# Altium schematic sheet ESP32_Schem_V2.SchDoc (part 2 of 4)
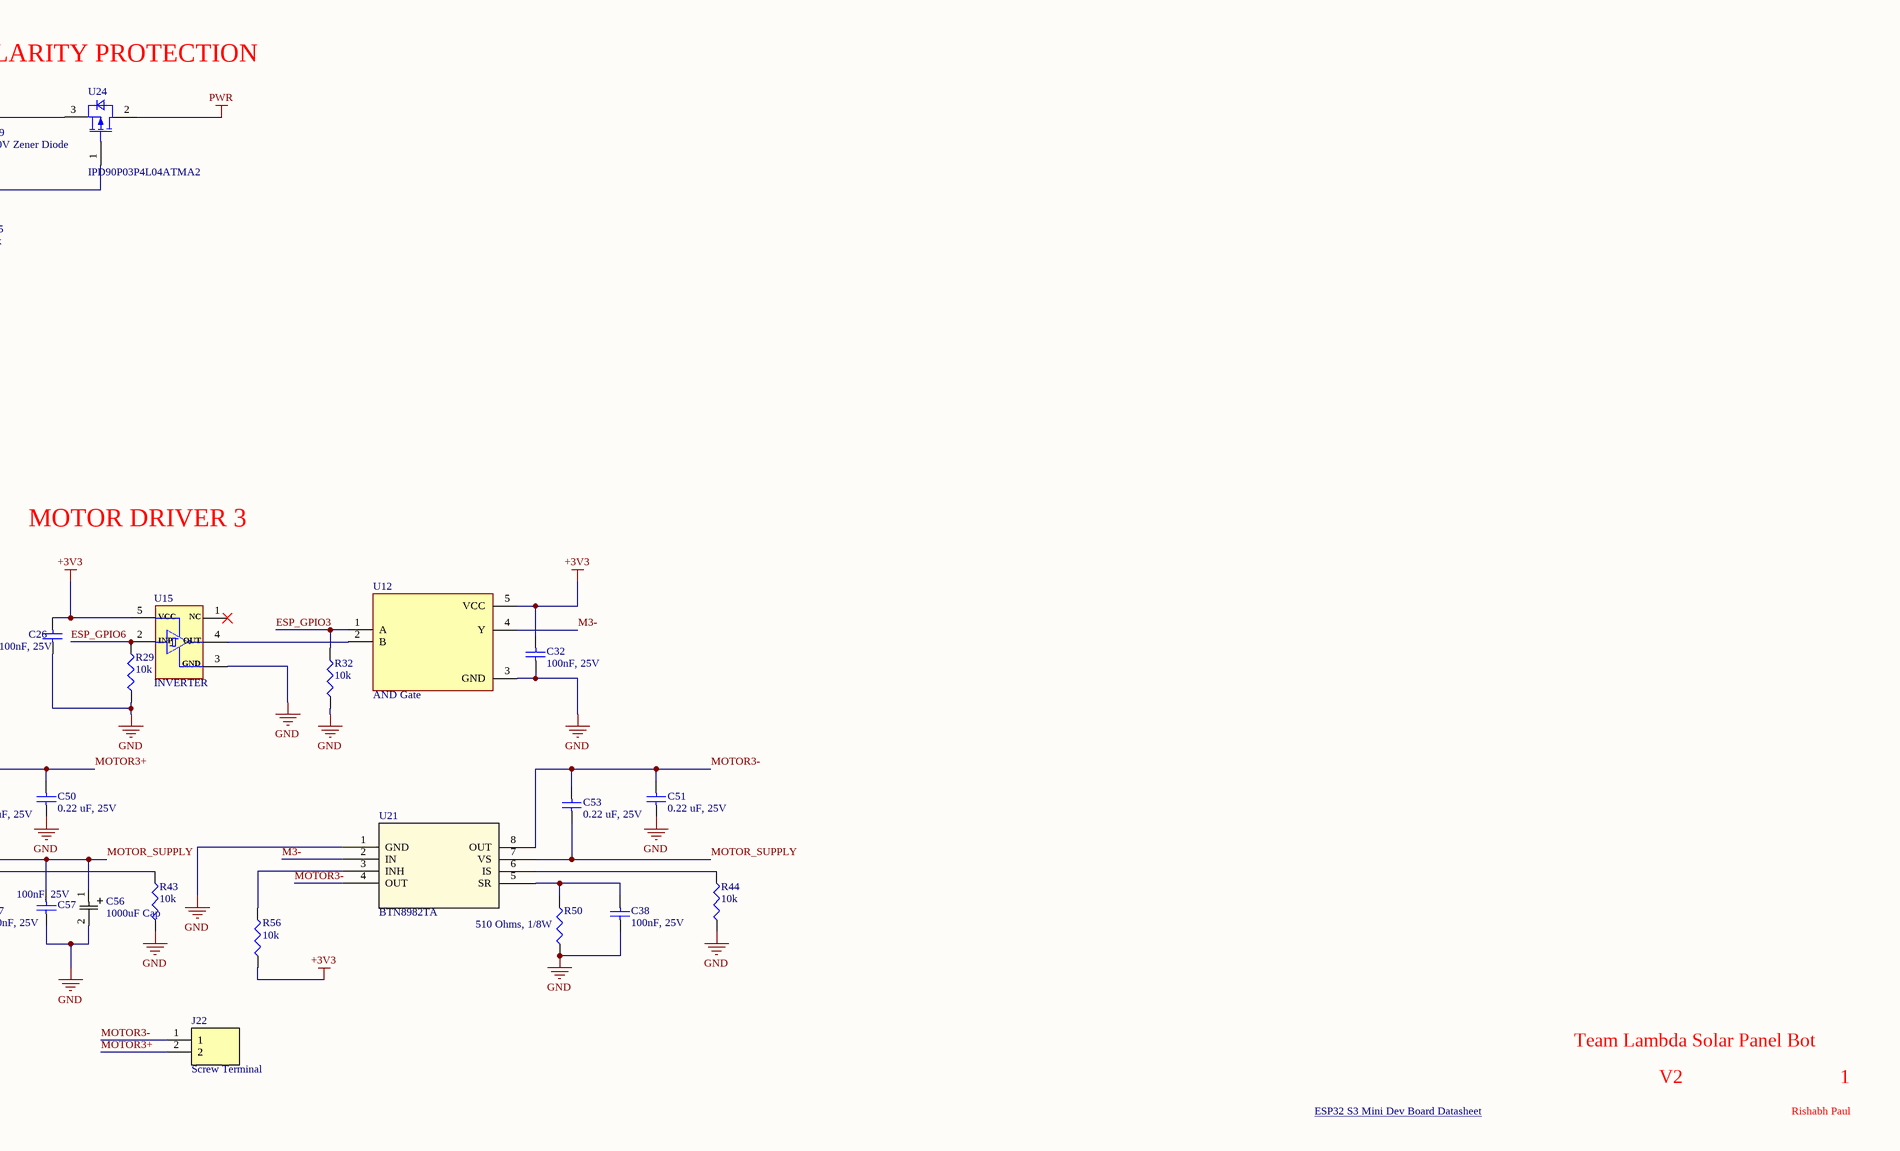
[diagram p4: ESP32_Schem_V2.SchDoc, bottom right]
## Library data of the parts
C1 C4 C19 C21-C23 C60 = CL05B104KB54PNC: Ceramic Capacitor, Multilayer, Ceramic, 50V, 10% +Tol, 10% -Tol, X7R, 15% TC, 0.1uF, Surface Mount, 0402; Manufacturer: Samsung; Supplier: Digikey; Supplier Part Number: 1276-CL05B104KB54PNCCT-ND; Manufacturer Part Number: CL05B104KB54PNC; RoHS: Yes; Category: Ceramic Capacitors; Stock: 379599; Pricing: 1=0.1, 10=0.037, 100=0.0211, 1000=0.01333, 2500=0.01141, 5000=0.01026 (USD); Pins: 2; Dielectric Material: Ceramic; Capacitor Type: Ceramic; RoHS Compliant: Yes; Reach SVHC Compliant: Yes; ComponentLink1URL: https://datasheet.ciiva.com:443/pdfs/VipMasterIC/IC/SEMS/SEMS-S-A0006318249/SEMS-S-A0006320959-1.pdf?src-supplier=IHS+Markit; ComponentLink1Description: https://datasheet.ciiva.com:443/pdfs/VipMasterIC/IC/SEMS/SEMS-S-A0006318249/SEMS-S-A0006320959-1.pdf?src-supplier=IHS+Markit; LCSC Part Number: C307331
C2 C15 C16 = CL05A106MP8NUB8: Ceramic Capacitor, Multilayer, Ceramic, 10V, 20% +Tol, 20% -Tol, X5R, 15% TC, 10uF, Surface Mount, 0402; Manufacturer: Samsung; Multilayer: Yes; Supplier: Digikey; Supplier Part Number: 1276-6830-1-ND; Manufacturer Part Number: CL05A106MP8NUB8; RoHS: Yes; Category: Ceramic Capacitors; Stock: 66904; Pricing: 1=0.16, 10=0.096, 100=0.0685 (USD); Mounting Technology: Surface Mount; Pins: 2; Dielectric Material: Ceramic; Package Shape: Rectangular; Case/Package: 0402; Terminal Finish: Nickel; Min Operating Temperature: -55°C; Max Operating Temperature: 85°C; JESD-609 Code: e3; Value: 10uF; Capacitor Type: Ceramic; Tolerance  (fill in as +-): 20%; Packaging: Tape and Reel; Tolerance (fill in as +-): 20%; Rated DC Voltage (URdc): 10V; Temperature Characteristics Code: X5R; Termination: Wraparound; Reach SVHC Compliant: Yes; RoHS Compliant: Yes; ComponentLink1URL: https://datasheet.ciiva.com:443/pdfs/VipMasterIC/IC/SEMS/SEMS-S-A0008521219/SEMS-S-A0008521325-1.pdf?src-supplier=IHS+Markit; ComponentLink1Description: https://datasheet.ciiva.com:443/pdfs/VipMasterIC/IC/SEMS/SEMS-S-A0008521219/SEMS-S-A0008521325-1.pdf?src-supplier=IHS+Markit; ComponentLink2URL: http://www.samsungsem.com/kr/support/product-search/mlcc/CL05A106MP8NUB8.jsp?src-supplier=Digikey; ComponentLink2Description: http://www.samsungsem.com/kr/support/product-search/mlcc/CL05A106MP8NUB8.jsp?src-supplier=Digikey; ComponentLink3URL: https://datasheet.octopart.com/CL05A106MP8NUB8-Samsung-Electro-Mechanics-datasheet-136460857.pdf?src-supplier=Future+Electronics; ComponentLink3Description: https://datasheet.octopart.com/CL05A106MP8NUB8-Samsung-Electro-Mechanics-datasheet-136460857.pdf?src-supplier=Future+Electronics; LCSC Part Number: C307415
C3 = CL05A105KL5NRNC: Ceramic Capacitor, Multilayer, Ceramic, 35V, 10% +Tol, 10% -Tol, X5R, 15% TC, 1uF, Surface Mount, 0402; Manufacturer: Samsung; Multilayer: Yes; Supplier: Digikey; Supplier Part Number: 1276-6796-1-ND; Manufacturer Part Number: CL05A105KL5NRNC; RoHS: Yes; Category: Ceramic Capacitors; Stock: 103267; Pricing: 1=0.29, 10=0.17, 100=0.1097, 1000=0.07829, 2500=0.07048, 5000=0.06578 (USD); Mounting Technology: Surface Mount; Pins: 2; Dielectric Material: Ceramic; Package Shape: Rectangular; Case/Package: 0402; Terminal Finish: Nickel; Min Operating Temperature: -55°C; Max Operating Temperature: 85°C; JESD-609 Code: e3; Value: 1uF; Capacitor Type: Ceramic; Tolerance  (fill in as +-): 10%; Packaging: Tape and Reel; Tolerance (fill in as +-): 10%; Rated DC Voltage (URdc): 35V; Temperature Characteristics Code: X5R; Termination: Wraparound; Reach SVHC Compliant: Yes; RoHS Compliant: Yes; ComponentLink1URL: https://datasheet.ciiva.com:443/pdfs/VipMasterIC/IC/SEMS/SEMS-S-A0008384515/SEMS-S-A0008872905-1.pdf?src-supplier=IHS+Markit; ComponentLink1Description: https://datasheet.ciiva.com:443/pdfs/VipMasterIC/IC/SEMS/SEMS-S-A0008384515/SEMS-S-A0008872905-1.pdf?src-supplier=IHS+Markit; ComponentLink2URL: http://www.samsungsem.com/kr/support/product-search/mlcc/CL05A105KL5NRNC.jsp?src-supplier=Digikey; ComponentLink2Description: http://www.samsungsem.com/kr/support/product-search/mlcc/CL05A105KL5NRNC.jsp?src-supplier=Digikey; ComponentLink3URL: https://datasheet.octopart.com/CL05A105KL5NRNC-Samsung-datasheet-8326407.pdf?src-supplier=TME; ComponentLink3Description: https://datasheet.octopart.com/CL05A105KL5NRNC-Samsung-datasheet-8326407.pdf?src-supplier=TME; LCSC Part Number: C307413
C5 C24-C38 C45 C55 C57 = CC0805KRX7R8BB104: 25V 100Nf X7R 10% 0805 Multilayer Ceramic Capacitors Mlcc Smd/Smt Rohs; Manufacturer: Yageo Group; Manufacturer Package Identifier: CC0805-0.85; Insulation Resistance: 100GΩ; Supplier: DigiKey; Supplier Part Number: 311-1141-1-ND; Manufacturer Part Number: CC0805KRX7R8BB104; RoHS: Compliant; Category: Ceramic Capacitors; ComponentLink1URL: https://datasheet.octopart.com:443/CC0805KRX7R8BB104-Yageo-datasheet-177165144.pdf?src-supplier=IHS; ComponentLink1Description: https://datasheet.octopart.com:443/CC0805KRX7R8BB104-Yageo-datasheet-177165144.pdf?src-supplier=IHS; ComponentLink2URL: https://datasheet.octopart.com:443/CC0805KRX7R8BB104-Yageo-datasheet-78855689.pdf?src-supplier=Upverter; ComponentLink2Description: https://datasheet.octopart.com:443/CC0805KRX7R8BB104-Yageo-datasheet-78855689.pdf?src-supplier=Upverter; LCSC Part Number: C519981; Stock: 145807; Pricing: 1=0.11, 10=0.059, 50=0.0406, 100=0.035, 500=0.02578, 1000=0.02295 (USD); Value: 100nF; Case/Package: 0805; Case Code (Imperial): 0805; Case Code (Metric): 2012; China RoHS: Compliant; Composition: Ceramic; Depth: 1.25mm; Dielectric: X7R; Dielectric Material: Ceramic; Halogen Free: Halogen Free; Height: 850µm; Lead Free: Lead Free; Length: 2mm; Lifecycle Status: Production; Material: Ceramic; Max Operating Temperature: 125°C; Min Operating Temperature: -55°C; Mounting Technology: Surface Mount; Pins: 2; Number of Terminals: 2; Radiation Hardening: No; REACH SVHC: Yes; Schedule B: 8532240020, 8532240020|8532240020, 8532240020|8532240020|8532240020, 8532240020|8532240020|8532240020|8532240020; Termination: SMD/SMT; Thickness: 838.2µm; Tolerance: 10%; Voltage Rating: 25V; Voltage Rating (DC): 25V; Width: 1.25mm; ComponentLink3URL: https://datasheet.octopart.com/CC0805KRX7R8BB104-Yageo-datasheet-10883670.pdf; ComponentLink3Description: https://datasheet.octopart.com/CC0805KRX7R8BB104-Yageo-datasheet-10883670.pdf; ComponentLink4URL: https://datasheet.octopart.com:443/CC0805KRX7R8BB104-Yageo-datasheet-181969809.pdf?src-supplier=Newark; ComponentLink4Description: https://datasheet.octopart.com:443/CC0805KRX7R8BB104-Yageo-datasheet-181969809.pdf?src-supplier=Newark; ComponentLink5URL: https://datasheet.octopart.com:443/CC0805KRX7R8BB104-Yageo-datasheet-147453679.pdf?src-supplier=Newark; ComponentLink5Description: https://datasheet.octopart.com:443/CC0805KRX7R8BB104-Yageo-datasheet-147453679.pdf?src-supplier=Newark; ComponentLink6URL: https://datasheet.octopart.com:443/CC0805KRX7R8BB104-Yageo-datasheet-499490.pdf?src-supplier=Newark; ComponentLink6Description: https://datasheet.octopart.com:443/CC0805KRX7R8BB104-Yageo-datasheet-499490.pdf?src-supplier=Newark; ComponentLink7URL: https://datasheet.octopart.com:443/CC0805KRX7R8BB104-Yageo-datasheet-5301394.pdf?src-supplier=Newark; ComponentLink7Description: https://datasheet.octopart.com:443/CC0805KRX7R8BB104-Yageo-datasheet-5301394.pdf?src-supplier=Newark; ComponentLink8URL: https://datasheet.octopart.com:443/CC0805KRX7R8BB104-Yageo-datasheet-62336348.pdf?src-supplier=Newark; ComponentLink8Description: https://datasheet.octopart.com:443/CC0805KRX7R8BB104-Yageo-datasheet-62336348.pdf?src-supplier=Newark; ComponentLink9URL: https://datasheet.octopart.com:443/CC0805KRX7R8BB104-Yageo-datasheet-151948686.pdf?src-supplier=Farnell; ComponentLink9Description: https://datasheet.octopart.com:443/CC0805KRX7R8BB104-Yageo-datasheet-151948686.pdf?src-supplier=Farnell; ComponentLink10URL: https://datasheet.octopart.com:443/CC0805KRX7R8BB104-Yageo-datasheet-500777.pdf?src-supplier=Farnell; ComponentLink10Description: https://datasheet.octopart.com:443/CC0805KRX7R8BB104-Yageo-datasheet-500777.pdf?src-supplier=Farnell; ComponentLink11URL: https://datasheet.octopart.com:443/CC0805KRX7R8BB104-Yageo-datasheet-166511530.pdf?src-supplier=Future+Electronics; ComponentLink11Description: https://datasheet.octopart.com:443/CC0805KRX7R8BB104-Yageo-datasheet-166511530.pdf?src-supplier=Future+Electronics; ComponentLink12URL: https://datasheet.octopart.com:443/CC0805KRX7R8BB104-Yageo-datasheet-137700082.pdf?src-supplier=Future+Electronics; ComponentLink12Description: https://datasheet.octopart.com:443/CC0805KRX7R8BB104-Yageo-datasheet-137700082.pdf?src-supplier=Future+Electronics; ComponentLink13URL: https://datasheet.octopart.com:443/CC0805KRX7R8BB104-Yageo-datasheet-137700084.pdf?src-supplier=Future+Electronics; ComponentLink13Description: https://datasheet.octopart.com:443/CC0805KRX7R8BB104-Yageo-datasheet-137700084.pdf?src-supplier=Future+Electronics; ComponentLink14URL: https://datasheet.octopart.com:443/CC0805KRX7R8BB104-Yageo-datasheet-27626582.pdf?src-supplier=Future+Electronics; ComponentLink14Description: https://datasheet.octopart.com:443/CC0805KRX7R8BB104-Yageo-datasheet-27626582.pdf?src-supplier=Future+Electronics; ComponentLink15URL: https://datasheet.octopart.com:443/CC0805KRX7R8BB104-Yageo-datasheet-15895757.pdf?src-supplier=Future+Electronics; ComponentLink15Description: https://datasheet.octopart.com:443/CC0805KRX7R8BB104-Yageo-datasheet-15895757.pdf?src-supplier=Future+Electronics; ComponentLink16URL: https://datasheet.octopart.com:443/CC0805KRX7R8BB104-Yageo-datasheet-12526321.pdf?src-supplier=Future+Electronics; ComponentLink16Description: https://datasheet.octopart.com:443/CC0805KRX7R8BB104-Yageo-datasheet-12526321.pdf?src-supplier=Future+Electronics; ComponentLink17URL: https://datasheet.octopart.com:443/CC0805KRX7R8BB104-Yageo-datasheet-8324192.pdf?src-supplier=Future+Electronics; ComponentLink17Description: https://datasheet.octopart.com:443/CC0805KRX7R8BB104-Yageo-datasheet-8324192.pdf?src-supplier=Future+Electronics; ComponentLink18URL: https://datasheet.octopart.com:443/CC0805KRX7R8BB104-Yageo-Group-datasheet-165992755.pdf?src-supplier=ODG+(Origin+Data+Global); ComponentLink18Description: https://datasheet.octopart.com:443/CC0805KRX7R8BB104-Yageo-Group-datasheet-165992755.pdf?src-supplier=ODG+(Origin+Data+Global); ComponentLink19URL: https://datasheet.octopart.com:443/CC0805KRX7R8BB104-Yageo-datasheet-8701427.pdf?src-supplier=element14; ComponentLink19Description: https://datasheet.octopart.com:443/CC0805KRX7R8BB104-Yageo-datasheet-8701427.pdf?src-supplier=element14; ComponentLink20URL: https://datasheet.octopart.com:443/CC0805KRX7R8BB104-Yageo-datasheet-8555986.pdf?src-supplier=TME; ComponentLink20Description: https://datasheet.octopart.com:443/CC0805KRX7R8BB104-Yageo-datasheet-8555986.pdf?src-supplier=TME; ComponentLink21URL: https://datasheet.octopart.com:443/CC0805KRX7R8BB104-Yageo-datasheet-17600895.pdf?src-supplier=TME; ComponentLink21Description: https://datasheet.octopart.com:443/CC0805KRX7R8BB104-Yageo-datasheet-17600895.pdf?src-supplier=TME; ComponentLink22URL: https://datasheet.octopart.com:443/CC0805KRX7R8BB104-Yageo-datasheet-118396.pdf?src-supplier=DigiKey; ComponentLink22Description: https://datasheet.octopart.com:443/CC0805KRX7R8BB104-Yageo-datasheet-118396.pdf?src-supplier=DigiKey; ComponentLink23URL: http://sigma.octopart.com:80/conflict_mineral_statement/Yageo-company-3.pdf?src-supplier=Compliance+Statements; ComponentLink23Description: http://sigma.octopart.com:80/conflict_mineral_statement/Yageo-company-3.pdf?src-supplier=Compliance+Statements; ComponentLink24URL: http://sigma.octopart.com:80/rohs_statement/Yageo-company-2.pdf?src-supplier=Compliance+Statements; ComponentLink24Description: http://sigma.octopart.com:80/rohs_statement/Yageo-company-2.pdf?src-supplier=Compliance+Statements
C6 C20 = CL05A475MO5NUNC: Ceramic Capacitor, Multilayer, Ceramic, 16V, 20% +Tol, 20% -Tol, X5R, 15% TC, 4.7uF, Surface Mount, 0402; Manufacturer: Samsung; Multilayer: Yes; Supplier: Digikey; Supplier Part Number: 1276-6836-1-ND; Manufacturer Part Number: CL05A475MO5NUNC; RoHS: Yes; Category: Ceramic Capacitors; Stock: 55189; Pricing: 1=0.19, 10=0.114, 100=0.0851 (USD); Mounting Technology: Surface Mount; Pins: 2; Dielectric Material: Ceramic; Package Shape: Rectangular; Case/Package: 0402; Terminal Finish: Nickel; Min Operating Temperature: -55°C; Max Operating Temperature: 85°C; JESD-609 Code: e3; Value: 4.7uF; Capacitor Type: Ceramic; Tolerance  (fill in as +-): 20%; Package Style: SMTMeter; Packaging: Tape and Reel; Tolerance (fill in as +-): 20%; Rated DC Voltage (URdc): 16V; Temperature Characteristics Code: X5R; Termination: Wraparound; Length: 1mm; Width: 0.5mm; Height: 0.7mm; Reach SVHC Compliant: Yes; RoHS Compliant: Yes; ComponentLink1URL: https://datasheet.ciiva.com:443/pdfs/VipMasterIC/IC/SEMS/SEMS-S-A0008384515/SEMS-S-A0008898881-1.pdf?src-supplier=IHS+Markit; ComponentLink1Description: https://datasheet.ciiva.com:443/pdfs/VipMasterIC/IC/SEMS/SEMS-S-A0008384515/SEMS-S-A0008898881-1.pdf?src-supplier=IHS+Markit; ComponentLink2URL: http://www.farnell.com/datasheets/2710653.pdf?src-supplier=Farnell; ComponentLink2Description: http://www.farnell.com/datasheets/2710653.pdf?src-supplier=Farnell; ComponentLink3URL: http://www.samsungsem.com/kr/support/product-search/mlcc/CL05A475MO5NUNC.jsp?src-supplier=Digikey; ComponentLink3Description: http://www.samsungsem.com/kr/support/product-search/mlcc/CL05A475MO5NUNC.jsp?src-supplier=Digikey; ComponentLink4URL: http://www.farnell.com/datasheets/2710653.pdf?src-supplier=Newark; ComponentLink4Description: http://www.farnell.com/datasheets/2710653.pdf?src-supplier=Newark; ComponentLink5URL: http://www.farnell.com/datasheets/2710653.pdf?src-supplier=Element14; ComponentLink5Description: http://www.farnell.com/datasheets/2710653.pdf?src-supplier=Element14; ComponentLink6URL: https://datasheet.octopart.com/CL05A475MO5NUNC-Samsung-Electro-Mechanics-datasheet-123102911.pdf?src-supplier=Future+Electronics; ComponentLink6Description: https://datasheet.octopart.com/CL05A475MO5NUNC-Samsung-Electro-Mechanics-datasheet-123102911.pdf?src-supplier=Future+Electronics; LCSC Part Number: C318563
C17 C39 C61 = TMK212BBJ106KG-T: CAP CER 10UF 25V X5R 0805; Manufacturer: TAIYO YUDEN; Value: 10µF; Dielectric Material: Ceramic; Tolerance: 10%; Voltage: 16V; Supplier: DigiKey; Supplier Part Number: 587-2985-1-ND; Manufacturer Part Number: TMK212BBJ106KG-T; RoHS: Compliant; Category: Ceramic Capacitors; Stock: 1004631; Pricing: 1=0.16, 10=0.088, 50=0.0622, 100=0.0543, 500=0.04086, 1000=0.03673 (USD); LCSC Part Number: C386085; Case/Package: 0805; Case Code (Imperial): 0805; Case Code (Metric): 2012; Composition: Ceramic; Dielectric: X5R; Height: 1.25mm; Lead Free: Lead Free; Length: 2mm; Lifecycle Status: Production; Material: Ceramic; Max Operating Temperature: 85°C; Min Operating Temperature: -55°C; Mounting Technology: Surface Mount; Pins: 2; Number of Terminals: 2; REACH SVHC: Yes; Termination: SMD/SMT; Thickness: 1.3462mm; Voltage Rating: 25V; Voltage Rating (DC): 25V; Width: 1.25mm; ComponentLink1URL: https://datasheet.octopart.com:443/TMK212BBJ106KG-T-Taiyo-Yuden-datasheet-182120866.pdf?src-supplier=IHS; ComponentLink1Description: https://datasheet.octopart.com:443/TMK212BBJ106KG-T-Taiyo-Yuden-datasheet-182120866.pdf?src-supplier=IHS; ComponentLink2URL: https://datasheet.octopart.com:443/TMK212BBJ106KG-T-Taiyo-Yuden-datasheet-181961944.pdf?src-supplier=Newark; ComponentLink2Description: https://datasheet.octopart.com:443/TMK212BBJ106KG-T-Taiyo-Yuden-datasheet-181961944.pdf?src-supplier=Newark; ComponentLink3URL: https://datasheet.octopart.com:443/TMK212BBJ106KG-T-Taiyo-Yuden-datasheet-23715841.pdf?src-supplier=Newark; ComponentLink3Description: https://datasheet.octopart.com:443/TMK212BBJ106KG-T-Taiyo-Yuden-datasheet-23715841.pdf?src-supplier=Newark; ComponentLink4URL: https://datasheet.octopart.com:443/TMK212BBJ106KG-T-Taiyo-Yuden-datasheet-10851928.pdf?src-supplier=element14+APAC; ComponentLink4Description: https://datasheet.octopart.com:443/TMK212BBJ106KG-T-Taiyo-Yuden-datasheet-10851928.pdf?src-supplier=element14+APAC; ComponentLink5URL: https://datasheet.octopart.com:443/TMK212BBJ106KG-T-Taiyo-Yuden-datasheet-154810078.pdf?src-supplier=Master+Electronics; ComponentLink5Description: https://datasheet.octopart.com:443/TMK212BBJ106KG-T-Taiyo-Yuden-datasheet-154810078.pdf?src-supplier=Master+Electronics; ComponentLink6URL: https://datasheet.octopart.com:443/TMK212BBJ106KG-T-Taiyo-Yuden-datasheet-10742123.pdf?src-supplier=Future+Electronics; ComponentLink6Description: https://datasheet.octopart.com:443/TMK212BBJ106KG-T-Taiyo-Yuden-datasheet-10742123.pdf?src-supplier=Future+Electronics; ComponentLink7URL: https://datasheet.octopart.com:443/TMK212BBJ106KG-T-Taiyo-Yuden-datasheet-99833418.pdf?src-supplier=Future+Electronics; ComponentLink7Description: https://datasheet.octopart.com:443/TMK212BBJ106KG-T-Taiyo-Yuden-datasheet-99833418.pdf?src-supplier=Future+Electronics; ComponentLink8URL: https://datasheet.octopart.com:443/TMK212BBJ106KG-T-Taiyo-Yuden-datasheet-138738940.pdf?src-supplier=Taiyo+Yuden+SCT; ComponentLink8Description: https://datasheet.octopart.com:443/TMK212BBJ106KG-T-Taiyo-Yuden-datasheet-138738940.pdf?src-supplier=Taiyo+Yuden+SCT; ComponentLink9URL: https://datasheet.octopart.com:443/TMK212BBJ106KG-T-Taiyo-Yuden-datasheet-27089299.pdf?src-supplier=Electro+Sonic; ComponentLink9Description: https://datasheet.octopart.com:443/TMK212BBJ106KG-T-Taiyo-Yuden-datasheet-27089299.pdf?src-supplier=Electro+Sonic
C18 C58 = C1608X5R1A226M080AC: CAP CER 22UF 10V X5R 0603; Manufacturer: TDK; Dielectric Material: Ceramic; Multilayer: Yes; Tolerance  (fill in as +-): 20%; Supplier: Digikey; Supplier Part Number: 445-9077-1-ND; Manufacturer Part Number: C1608X5R1A226M080AC; RoHS: Yes; Category: Ceramic Capacitors; Stock: 11207; Pricing: 1=0.29, 10=0.169, 50=0.123, 100=0.092, 500=0.0849, 1000=0.07756 (USD); Mounting Technology: Surface Mount; Pins: 2; Package Shape: Rectangular; Case/Package: 0603; Terminal Finish: Nickel; Min Operating Temperature: -55°C; Max Operating Temperature: 85°C; JESD-609 Code: e3; Value: 22uF; Capacitor Type: Ceramic; Package Style: SMTMeter; Packaging: Tape and Reel; Tolerance (fill in as +-): 20%; Rated DC Voltage (URdc): 10V; Temperature Characteristics Code: X5R; Termination: Wraparound; Length: 1.6mm; Width: 0.8mm; Height: 0.8mm; Reach SVHC Compliant: Yes; RoHS Compliant: Yes; ComponentLink1URL: https://datasheet.ciiva.com:443/pdfs/VipMasterIC/IC/TDKC/TDKC-S-A0008796792/TDKC-S-A0008796792-1.pdf?src-supplier=IHS+Markit; ComponentLink1Description: https://datasheet.ciiva.com:443/pdfs/VipMasterIC/IC/TDKC/TDKC-S-A0008796792/TDKC-S-A0008796792-1.pdf?src-supplier=IHS+Markit; ComponentLink2URL: http://www.farnell.com/datasheets/2792994.pdf?src-supplier=Farnell; ComponentLink2Description: http://www.farnell.com/datasheets/2792994.pdf?src-supplier=Farnell; ComponentLink3URL: http://www.farnell.com/datasheets/2792994.pdf?src-supplier=Element14; ComponentLink3Description: http://www.farnell.com/datasheets/2792994.pdf?src-supplier=Element14; ComponentLink4URL: https://datasheet.octopart.com/C1608X5R1A226M080AC-TDK-datasheet-13444418.pdf?src-supplier=Future+Electronics; ComponentLink4Description: https://datasheet.octopart.com/C1608X5R1A226M080AC-TDK-datasheet-13444418.pdf?src-supplier=Future+Electronics; ComponentLink5URL: https://datasheet.octopart.com/C1608X5R1A226M080AC-TDK-datasheet-82475248.pdf?src-supplier=Newark; ComponentLink5Description: https://datasheet.octopart.com/C1608X5R1A226M080AC-TDK-datasheet-82475248.pdf?src-supplier=Newark; LCSC Part Number: C342824
C40-C43 C46-C53 = CC0603KRX7R8BB224: CAP CER 0.22UF 25V X7R 0603; Manufacturer: Yageo Group; Value: 220nF; Dielectric Material: Ceramic; Tolerance: 10%; Supplier: DigiKey; Supplier Part Number: 311-1803-1-ND; Manufacturer Part Number: CC0603KRX7R8BB224; RoHS: Compliant; Category: Ceramic Capacitors; Stock: 24200; Pricing: 1=0.12, 10=0.069, 50=0.048, 100=0.0416, 500=0.0309, 1000=0.02761 (USD); Case/Package: 0603; Case Code (Imperial): 0603; Case Code (Metric): 1608; China RoHS: Compliant; Composition: Ceramic; Depth: 800µm; Dielectric: X7R; Halogen Free: Halogen Free; Height: 800µm; Lead Free: Lead Free; Length: 1.6mm; Lifecycle Status: Production; Material: Ceramic; Max Operating Temperature: 125°C; Min Operating Temperature: -55°C; Mounting Technology: Surface Mount; Pins: 2; Number of Terminals: 2; Packaging: Tape and Reel; Radiation Hardening: No; REACH SVHC: Yes; Schedule B: 8532240020, 8532240020|8532240020, 8532240020|8532240020|8532240020, 8532240020|8532240020|8532240020|8532240020; Termination: SMD/SMT; Thickness: 889µm; Voltage: 25V; Voltage Rating: 25V; Voltage Rating (DC): 25V; Width: 800µm; ComponentLink1URL: https://datasheet.octopart.com:443/CC0603KRX7R8BB224-Yageo-datasheet-177165144.pdf?src-supplier=IHS; ComponentLink1Description: https://datasheet.octopart.com:443/CC0603KRX7R8BB224-Yageo-datasheet-177165144.pdf?src-supplier=IHS; ComponentLink2URL: https://datasheet.octopart.com:443/CC0603KRX7R8BB224-Yageo-datasheet-82288757.pdf?src-supplier=Upverter; ComponentLink2Description: https://datasheet.octopart.com:443/CC0603KRX7R8BB224-Yageo-datasheet-82288757.pdf?src-supplier=Upverter; ComponentLink3URL: https://datasheet.octopart.com:443/CC0603KRX7R8BB224-Yageo-datasheet-181968713.pdf?src-supplier=Newark; ComponentLink3Description: https://datasheet.octopart.com:443/CC0603KRX7R8BB224-Yageo-datasheet-181968713.pdf?src-supplier=Newark; ComponentLink4URL: https://datasheet.octopart.com:443/CC0603KRX7R8BB224-Yageo-datasheet-140260305.pdf?src-supplier=Newark; ComponentLink4Description: https://datasheet.octopart.com:443/CC0603KRX7R8BB224-Yageo-datasheet-140260305.pdf?src-supplier=Newark; ComponentLink5URL: https://datasheet.octopart.com:443/CC0603KRX7R8BB224-Yageo-datasheet-147453679.pdf?src-supplier=Farnell; ComponentLink5Description: https://datasheet.octopart.com:443/CC0603KRX7R8BB224-Yageo-datasheet-147453679.pdf?src-supplier=Farnell; ComponentLink6URL: https://datasheet.octopart.com:443/CC0603KRX7R8BB224-Yageo-Group-datasheet-188689702.pdf?src-supplier=Farnell; ComponentLink6Description: https://datasheet.octopart.com:443/CC0603KRX7R8BB224-Yageo-Group-datasheet-188689702.pdf?src-supplier=Farnell; ComponentLink7URL: https://datasheet.octopart.com:443/CC0603KRX7R8BB224-Yageo-datasheet-27626582.pdf?src-supplier=Future+Electronics; ComponentLink7Description: https://datasheet.octopart.com:443/CC0603KRX7R8BB224-Yageo-datasheet-27626582.pdf?src-supplier=Future+Electronics; ComponentLink8URL: https://datasheet.octopart.com:443/CC0603KRX7R8BB224-Yageo-datasheet-166511530.pdf?src-supplier=Future+Electronics; ComponentLink8Description: https://datasheet.octopart.com:443/CC0603KRX7R8BB224-Yageo-datasheet-166511530.pdf?src-supplier=Future+Electronics; ComponentLink9URL: https://datasheet.octopart.com:443/CC0603KRX7R8BB224-Yageo-datasheet-137700082.pdf?src-supplier=Future+Electronics; ComponentLink9Description: https://datasheet.octopart.com:443/CC0603KRX7R8BB224-Yageo-datasheet-137700082.pdf?src-supplier=Future+Electronics; ComponentLink10URL: https://datasheet.octopart.com:443/CC0603KRX7R8BB224-Yageo-datasheet-42079887.pdf?src-supplier=Future+Electronics; ComponentLink10Description: https://datasheet.octopart.com:443/CC0603KRX7R8BB224-Yageo-datasheet-42079887.pdf?src-supplier=Future+Electronics; ComponentLink11URL: https://datasheet.octopart.com/CC0603KRX7R8BB224-Yageo-datasheet-10883670.pdf; ComponentLink11Description: https://datasheet.octopart.com/CC0603KRX7R8BB224-Yageo-datasheet-10883670.pdf; ComponentLink12URL: https://datasheet.octopart.com/Surface-Mount-Ceramic-Multilayer-Capacitors%3B-General-Purpose-%26-High-Capacitance-Class-2%2C-X7R-Yageo-datasheet-family-114.pdf; ComponentLink12Description: https://datasheet.octopart.com/Surface-Mount-Ceramic-Multilayer-Capacitors%3B-General-Purpose-%26-High-Capacitance-Class-2%2C-X7R-Yageo-datasheet-family-114.pdf; ComponentLink13URL: https://datasheet.octopart.com:443/CC0603KRX7R8BB224-Yageo-Group-datasheet-165992755.pdf?src-supplier=ODG+(Origin+Data+Global); ComponentLink13Description: https://datasheet.octopart.com:443/CC0603KRX7R8BB224-Yageo-Group-datasheet-165992755.pdf?src-supplier=ODG+(Origin+Data+Global); ComponentLink14URL: https://datasheet.octopart.com:443/CC0603KRX7R8BB224-Yageo-datasheet-151948686.pdf?src-supplier=TME; ComponentLink14Description: https://datasheet.octopart.com:443/CC0603KRX7R8BB224-Yageo-datasheet-151948686.pdf?src-supplier=TME; ComponentLink15URL: https://datasheet.octopart.com:443/CC0603KRX7R8BB224-Yageo-datasheet-120101875.pdf?src-supplier=Megastar; ComponentLink15Description: https://datasheet.octopart.com:443/CC0603KRX7R8BB224-Yageo-datasheet-120101875.pdf?src-supplier=Megastar; ComponentLink16URL: http://sigma.octopart.com:80/rohs_statement/Surface-Mount-Ceramic-Multilayer-Capacitors%3B-General-Purpose-%26-High-Capacitance-Class-2%2C-X7R-Yageo-family-124.pdf?src-supplier=Compliance+Statements; ComponentLink16Description: http://sigma.octopart.com:80/rohs_statement/Surface-Mount-Ceramic-Multilayer-Capacitors%3B-General-Purpose-%26-High-Capacitance-Class-2%2C-X7R-Yageo-family-124.pdf?src-supplier=Compliance+Statements; ComponentLink17URL: http://sigma.octopart.com:80/reach_statement/Surface-Mount-Ceramic-Multilayer-Capacitors%3B-General-Purpose-%26-High-Capacitance-Class-2%2C-X7R-Yageo-family-125.pdf?src-supplier=Compliance+Statements; ComponentLink17Description: http://sigma.octopart.com:80/reach_statement/Surface-Mount-Ceramic-Multilayer-Capacitors%3B-General-Purpose-%26-High-Capacitance-Class-2%2C-X7R-Yageo-family-125.pdf?src-supplier=Compliance+Statements; ComponentLink18URL: http://sigma.octopart.com:80/conflict_mineral_statement/Yageo-company-3.pdf?src-supplier=Compliance+Statements; ComponentLink18Description: http://sigma.octopart.com:80/conflict_mineral_statement/Yageo-company-3.pdf?src-supplier=Compliance+Statements; ComponentLink19URL: http://sigma.octopart.com:80/rohs_statement/Yageo-company-2.pdf?src-supplier=Compliance+Statements; ComponentLink19Description: http://sigma.octopart.com:80/rohs_statement/Yageo-company-2.pdf?src-supplier=Compliance+Statements; LCSC Part Number: C106857
C44 C54 C56 = 35PX1000MEFC10X20: CAP ALUM 1000UF 20% 35V RADIAL; Manufacturer: Rubycon; Value: 1mF; Life (Hours): 2000hours; Ripple Current: 865mA; Supplier: DigiKey; Supplier Part Number: 1189-1745-ND; Manufacturer Part Number: 35PX1000MEFC10X20; RoHS: Compliant; Category: Aluminum Electrolytic Capacitors; Stock: 53684; Pricing: 1=0.85, 10=0.523, 50=0.4036, 100=0.3616, 500=0.28922, 1000=0.2681 (USD); Case/Package: Radial; Diameter: 10mm; Height: 20mm; Height - Seated (Max): 21.9964mm; Lead Pitch: 5mm; Length: 20mm; Lifecycle Status: Production; Max Operating Temperature: 105°C; Min Operating Temperature: -55°C; Mounting Technology: Through Hole; Pins: 2; Number of Terminals: 2; Packaging: Bulk; Radiation Hardening: No; REACH SVHC: Yes; Ripple Current (AC): 865mA; Schedule B: 8532220020, 8532220020|8532220020|8532220020|8532220020|8532220020; Terminal Pitch: 5mm; Termination: Radial; Tolerance: 20%; Voltage Rating: 35V; Voltage Rating (DC): 35V; ComponentLink1URL: https://datasheet.octopart.com:443/35PX1000MEFC10X20-Rubycon-datasheet-159569471.pdf?src-supplier=IHS; ComponentLink1Description: https://datasheet.octopart.com:443/35PX1000MEFC10X20-Rubycon-datasheet-159569471.pdf?src-supplier=IHS; ComponentLink2URL: https://datasheet.octopart.com:443/35PX1000MEFC10X20-Rubycon-datasheet-86451557.pdf?src-supplier=JRH+Electronics; ComponentLink2Description: https://datasheet.octopart.com:443/35PX1000MEFC10X20-Rubycon-datasheet-86451557.pdf?src-supplier=JRH+Electronics; ComponentLink3URL: https://datasheet.octopart.com:443/35PX1000MEFC10X20-Rubycon-datasheet-12529491.pdf?src-supplier=LKR; ComponentLink3Description: https://datasheet.octopart.com:443/35PX1000MEFC10X20-Rubycon-datasheet-12529491.pdf?src-supplier=LKR; ComponentLink4URL: https://datasheet.octopart.com:443/35PX1000MEFC10X20-Rubycon-datasheet-41169268.pdf?src-supplier=Newark; ComponentLink4Description: https://datasheet.octopart.com:443/35PX1000MEFC10X20-Rubycon-datasheet-41169268.pdf?src-supplier=Newark; ComponentLink5URL: https://datasheet.octopart.com:443/35PX1000MEFC10X20-Rubycon-datasheet-155906914.pdf?src-supplier=Future+Electronics; ComponentLink5Description: https://datasheet.octopart.com:443/35PX1000MEFC10X20-Rubycon-datasheet-155906914.pdf?src-supplier=Future+Electronics; LCSC Part Number: C136014
D7 = VLMS1500-GS08: Single Color LED, Super Red, 0.5mm; Manufacturer: Vishay; Shape: Rectangular; Forward Current: 30mA; Forward Voltage: 2.4V; Luminous Intensity-Nom: 54mcd; Channels: 1; Reverse Voltage-Max: 5V; Viewing Angle: 130°; Overall Height: 0.35mm; Supplier: Digikey; Supplier Part Number: VLMS1500-GS08CT-ND; Manufacturer Part Number: VLMS1500-GS08; RoHS: Yes; Category: LEDs; Stock: 21358; Pricing: 1=0.24, 10=0.164, 100=0.1147, 500=0.09218, 1000=0.0847 (USD); Mounting Technology: Surface Mount; Pins: 2; Color: Red; Color@wavelength: Red; Min Operating Temperature: -30°C; Max Operating Temperature: 85°C; Optoelectronic Device Type: SINGLE COLOR LED; Packaging: Tape and Reel; Size: 0.5mm; Terminal Pitch: 0.95mm; Reach SVHC Compliant: Yes; RoHS Compliant: Yes; ComponentLink1URL: https://datasheet.ciiva.com:443/pdfs/VipMasterIC/IC/VISH/VISH-S-A0003457490/VISH-S-A0003457490-1.pdf?src-supplier=IHS+Markit; ComponentLink1Description: https://datasheet.ciiva.com:443/pdfs/VipMasterIC/IC/VISH/VISH-S-A0003457490/VISH-S-A0003457490-1.pdf?src-supplier=IHS+Markit; ComponentLink2URL: http://www.farnell.com/datasheets/1809983.pdf?src-supplier=Farnell; ComponentLink2Description: http://www.farnell.com/datasheets/1809983.pdf?src-supplier=Farnell; ComponentLink3URL: http://www.mouser.com/ds/2/427/vlmo1500-244705.pdf?src-supplier=Mouser; ComponentLink3Description: http://www.mouser.com/ds/2/427/vlmo1500-244705.pdf?src-supplier=Mouser; ComponentLink4URL: http://www.alliedelec.com/m/d/cfc385e1097fc985ee9a50a3551ac188.pdf?src-supplier=Allied+Electronics; ComponentLink4Description: http://www.alliedelec.com/m/d/cfc385e1097fc985ee9a50a3551ac188.pdf?src-supplier=Allied+Electronics; ComponentLink5URL: https://datasheet.octopart.com/VLMS1500-GS08-Vishay-datasheet-62332426.pdf?src-supplier=Newark; ComponentLink5Description: https://datasheet.octopart.com/VLMS1500-GS08-Vishay-datasheet-62332426.pdf?src-supplier=Newark; ComponentLink6URL: https://datasheet.octopart.com/VLMS1500-GS08-Vishay-datasheet-33014519.pdf?src-supplier=Element14; ComponentLink6Description: https://datasheet.octopart.com/VLMS1500-GS08-Vishay-datasheet-33014519.pdf?src-supplier=Element14; ComponentLink7URL: http://datasheet.octopart.com/VLMS1500-GS08-Vishay-datasheet-21227148.pdf?src-supplier=Avnet; ComponentLink7Description: http://datasheet.octopart.com/VLMS1500-GS08-Vishay-datasheet-21227148.pdf?src-supplier=Avnet; ComponentLink8URL: http://www.farnell.com/datasheets/1809983.pdf?src-supplier=Newark; ComponentLink8Description: http://www.farnell.com/datasheets/1809983.pdf?src-supplier=Newark; ComponentLink9URL: http://www.farnell.com/datasheets/2050839.pdf?src-supplier=Newark; ComponentLink9Description: http://www.farnell.com/datasheets/2050839.pdf?src-supplier=Newark; ComponentLink10URL: https://datasheet.octopart.com/VLMS1500-GS08-Vishay-datasheet-21227148.pdf?src-supplier=Future+Electronics; ComponentLink10Description: https://datasheet.octopart.com/VLMS1500-GS08-Vishay-datasheet-21227148.pdf?src-supplier=Future+Electronics; ComponentLink11URL: http://datasheet.octopart.com/VLMS1500-GS08-Vishay-datasheet-21227148.pdf?src-supplier=Quest; ComponentLink11Description: http://datasheet.octopart.com/VLMS1500-GS08-Vishay-datasheet-21227148.pdf?src-supplier=Quest; ComponentLink12URL: http://datasheet.octopart.com/VLMS1500-GS08-Vishay-datasheet-21227148.pdf?src-supplier=NAC+Semi; ComponentLink12Description: http://datasheet.octopart.com/VLMS1500-GS08-Vishay-datasheet-21227148.pdf?src-supplier=NAC+Semi; LCSC Part Number: C511370
D8 = VLMG1500-GS08: Single Color LED, Yellow Green, 0.5mm; Manufacturer: Vishay; Color: Green,Yellow; Shape: Rectangular; Forward Current: 30mA; Forward Voltage: 2.4V; Luminous Intensity-Nom: 90mcd; Channels: 1; Reverse Voltage-Max: 5V; Viewing Angle: 130°; Overall Height: 0.35mm; Supplier: Digikey; Supplier Part Number: VLMG1500-GS08CT-ND; Manufacturer Part Number: VLMG1500-GS08; RoHS: Yes; Category: LEDs; Stock: 114352; Pricing: 1=0.24, 10=0.164, 100=0.1147, 500=0.09218, 1000=0.0847, 3000=0.07505, 6000=0.07012, 9000=0.06758, 15000=0.06472, 21000=0.06301, 30000=0.06135, 75000=0.05767, 150000=0.05537 (USD); Mounting Technology: Surface Mount; Pins: 2; Color@wavelength: Green; Min Operating Temperature: -30°C; Max Operating Temperature: 85°C; Optoelectronic Device Type: SINGLE COLOR LED; Packaging: Tape and Reel; Size: 0.5mm; Terminal Pitch: 0.95mm; Reach SVHC Compliant: Yes; RoHS Compliant: Yes; ComponentLink1URL: https://datasheet.ciiva.com:443/pdfs/VipMasterIC/IC/VISH/VISH-S-A0003457490/VISH-S-A0003457490-1.pdf?src-supplier=IHS+Markit; ComponentLink1Description: https://datasheet.ciiva.com:443/pdfs/VipMasterIC/IC/VISH/VISH-S-A0003457490/VISH-S-A0003457490-1.pdf?src-supplier=IHS+Markit; ComponentLink2URL: https://datasheet.ciiva.com/12071/vlmo1500-244705-12071911.pdf?src-supplier=Mouser; ComponentLink2Description: https://datasheet.ciiva.com/12071/vlmo1500-244705-12071911.pdf?src-supplier=Mouser; ComponentLink3URL: https://datasheet.ciiva.com/30005/vlmo1500-30005134.pdf?src-supplier=Avnet; ComponentLink3Description: https://datasheet.ciiva.com/30005/vlmo1500-30005134.pdf?src-supplier=Avnet; LCSC Part Number: C511404
D9 = BZT52C10LP-7: Zener Diode, 10V, 0.25W, X1-Dfn1006 Rohs Compliant: Yes |Diodes Inc. BZT52C10LP-7; Element Configuration: Single; ESD Protection: No; Forward Voltage: 900mV; Impedance: 20Ω; Max Power Dissipation: 250mW; Max Reverse Leakage Current: 200nA; Number of Elements: 1; Output Current: 50mA; Polarity: Unidirectional; Test Current: 5mA; Tolerance: 6%; Supplier: DigiKey; Supplier Part Number: BZT52C10LPDICT-ND; Manufacturer: Diodes Inc.; Manufacturer Part Number: BZT52C10LP-7; RoHS: Compliant; Category: Zener Diodes; Stock: 8970; Pricing: 1=0.27, 10=0.179, 100=0.087, 500=0.086, 1000=0.084 (USD); Case/Package: DFN; China RoHS: Compliant; Contact Plating: Gold; Height: 470µm; Lead Free: Lead Free; Length: 1mm; Lifecycle Status: Production; Max Operating Temperature: 150°C; Min Operating Temperature: -65°C; Mounting Technology: Surface Mount; Pins: 2; Number of Terminals: 2; Packaging: Cut Tape; Peak Reverse Current: 200nA; Power Dissipation: 250mW; Power Rating: 250mW; Radiation Hardening: No; REACH SVHC: Yes; Reference Voltage: 10V; Schedule B: 8541100050, 8541100050|8541100050|8541100050|8541100050|8541100050; Termination: SMD/SMT; Voltage Rating (DC): 10V; Voltage Tolerance: 6%; Weight: 992.233309µg; Width: 600µm; Working Voltage: 10V; Zener Current: 5mA; Zener Voltage: 10V; ComponentLink1URL: https://datasheet.octopart.com:443/BZT52C10LP-7-Diodes-Inc.-datasheet-159636660.pdf?src-supplier=IHS; ComponentLink1Description: https://datasheet.octopart.com:443/BZT52C10LP-7-Diodes-Inc.-datasheet-159636660.pdf?src-supplier=IHS; ComponentLink2URL: https://datasheet.octopart.com:443/BZT52C10LP-7-Diodes-Inc.-datasheet-46751199.pdf?src-supplier=Newark; ComponentLink2Description: https://datasheet.octopart.com:443/BZT52C10LP-7-Diodes-Inc.-datasheet-46751199.pdf?src-supplier=Newark; ComponentLink3URL: https://datasheet.octopart.com/BZT52C10LP-7-Diodes-Inc.-datasheet-10969858.pdf; ComponentLink3Description: https://datasheet.octopart.com/BZT52C10LP-7-Diodes-Inc.-datasheet-10969858.pdf; ComponentLink4URL: https://datasheet.octopart.com:443/BZT52C10LP-7-Diodes-Inc.-datasheet-101745785.pdf?src-supplier=Future+Electronics; ComponentLink4Description: https://datasheet.octopart.com:443/BZT52C10LP-7-Diodes-Inc.-datasheet-101745785.pdf?src-supplier=Future+Electronics; ComponentLink5URL: https://sigma.octopart.com:443/138891837/technical_drawing/Diodes-Inc.-BZT52C10LP-7.pdf?src-supplier=Diodes+Inc+SCT; ComponentLink5Description: https://sigma.octopart.com:443/138891837/technical_drawing/Diodes-Inc.-BZT52C10LP-7.pdf?src-supplier=Diodes+Inc+SCT; ComponentLink6URL: https://datasheet.octopart.com:443/BZT52C10LP-7-Diodes-Inc.-datasheet-14050984.pdf?src-supplier=iiiC; ComponentLink6Description: https://datasheet.octopart.com:443/BZT52C10LP-7-Diodes-Inc.-datasheet-14050984.pdf?src-supplier=iiiC; ComponentLink7URL: https://datasheet.octopart.com:443/BZT52C10LP-7-Diodes-Inc.-datasheet-165351.pdf?src-supplier=Mouser; ComponentLink7Description: https://datasheet.octopart.com:443/BZT52C10LP-7-Diodes-Inc.-datasheet-165351.pdf?src-supplier=Mouser; ComponentLink8URL: https://datasheet.octopart.com:443/BZT52C10LP-7-Diodes-Inc.-datasheet-38426.pdf?src-supplier=DigiKey; ComponentLink8Description: https://datasheet.octopart.com:443/BZT52C10LP-7-Diodes-Inc.-datasheet-38426.pdf?src-supplier=DigiKey; LCSC Part Number: C150509
D10-D12 = SP3022-01ETG: TVS DIODE 5.3VWM 12VC SOD882; Manufacturer: Littelfuse; Polarity: Bidirectional; Max Breakdown Voltage: 9V; Min Breakdown Voltage: 6.8V; Number of Elements: 1; Clamping Voltage: 12V; Leakage Current: 100nA; Max Power Dissipation: 20W; Max Surge Current: 3A; Peak Pulse Current: 1A; Power Line Protection: No; Reverse Standoff Voltage: 5.3V; Supplier: DigiKey; Supplier Part Number: F6709DKR-ND; Manufacturer Part Number: SP3022-01ETG; RoHS: Compliant; Category: TVS Diodes; Pricing: 1=0.17, 10=0.122 (USD); Pins: 2; Min Operating Temperature: -40°C; Max Operating Temperature: 125°C; ComponentLink1URL: https://datasheet.octopart.com:443/SP3022-01ETG-Littelfuse-datasheet-180609637.pdf?src-supplier=IHS; ComponentLink1Description: https://datasheet.octopart.com:443/SP3022-01ETG-Littelfuse-datasheet-180609637.pdf?src-supplier=IHS; ComponentLink2URL: https://datasheet.octopart.com:443/SP3022-01ETG-Littelfuse-datasheet-181956538.pdf?src-supplier=Newark; ComponentLink2Description: https://datasheet.octopart.com:443/SP3022-01ETG-Littelfuse-datasheet-181956538.pdf?src-supplier=Newark; ComponentLink3URL: https://datasheet.octopart.com:443/SP3022-01ETG-Littelfuse-datasheet-43876386.pdf?src-supplier=Newark; ComponentLink3Description: https://datasheet.octopart.com:443/SP3022-01ETG-Littelfuse-datasheet-43876386.pdf?src-supplier=Newark; LCSC Part Number: C126840; Case/Package: SOD-882-2; Composition: Zener; Lifecycle Status: Production; Mounting Technology: Surface Mount; Number of Bidirectional Channels: 1; Number of Channels: 1; Number of Terminals: 2; Peak Pulse Power: 20W; REACH SVHC: Yes; Termination: SMD/SMT; Working Voltage: 5.3V; ComponentLink4URL: https://datasheet.octopart.com:443/SP3022-01ETG-Littelfuse-datasheet-140480403.pdf?src-supplier=ODG+(Origin+Data+Global); ComponentLink4Description: https://datasheet.octopart.com:443/SP3022-01ETG-Littelfuse-datasheet-140480403.pdf?src-supplier=ODG+(Origin+Data+Global); ComponentLink5URL: https://datasheet.octopart.com:443/SP3022-01ETG-Littelfuse-datasheet-82968918.pdf?src-supplier=element14+APAC; ComponentLink5Description: https://datasheet.octopart.com:443/SP3022-01ETG-Littelfuse-datasheet-82968918.pdf?src-supplier=element14+APAC; ComponentLink6URL: https://datasheet.octopart.com:443/SP3022-01ETG-Littelfuse-datasheet-175469626.pdf?src-supplier=Future+Electronics; ComponentLink6Description: https://datasheet.octopart.com:443/SP3022-01ETG-Littelfuse-datasheet-175469626.pdf?src-supplier=Future+Electronics; ComponentLink7URL: https://datasheet.octopart.com:443/SP3022-01ETG-Littelfuse-datasheet-100434945.pdf?src-supplier=Future+Electronics; ComponentLink7Description: https://datasheet.octopart.com:443/SP3022-01ETG-Littelfuse-datasheet-100434945.pdf?src-supplier=Future+Electronics
D13 = SMBJ5.0A: TVS DIODE 5VWM 9.2VC DO214AA; Manufacturer: Littelfuse; Diode Element Material: SILICON; Package Body Material: Plastic; Polarity: Unidirectional; Max Breakdown Voltage: 7V; Min Breakdown Voltage: 6.4V; Breakdown Voltage-Nom: 6.7V; Clamping Voltage-Max: 9.2V; Diode Type: TRANS VOLTAGE SUPPRESSOR; Non-rep Peak Rev Power Dis-Max: 600W; Number of Elements: 1; Max Power Dissipation: 1.5W; Rep Pk Reverse Voltage-Max: 5V; Time @ Peak Reflow Temperature-Max (s): 40s; Additional Feature: UL RECOGNIZED; JEDEC-95 Code: DO-214AA; Qualification Status: Not Qualified; Supplier: Digikey; Supplier Part Number: SMBJ5.0ALFCT-ND; Manufacturer Part Number: SMBJ5.0A; RoHS: Yes; Category: TVS Diodes; Stock: 117308; Pricing: 1=0.23, 10=0.171, 100=0.105, 3000=0.075, 30000=0.07389, 75000=0.06719, 150000=0.06563 (USD); Pins: 2; Package Shape: Rectangular; Terminal Finish: Tin; Min Operating Temperature: -65°C; Max Operating Temperature: 150°C; JESD-30 Code: R-PDSO-C2; Moisture Sensitivity Level: 1; Package Style: SMALL OUTLINEMeter; Peak Reflow Temperature (Cel): 260°C; Surface Mount: Yes; Technology: AVALANCHE; Terminal Form: C BEND; Terminal Position: DUAL; JESD-609 Code: e3; RoHS Compliant: Yes; Reach SVHC Compliant: No; ComponentLink1URL: https://datasheet.ciiva.com:443/pdfs/VipMasterIC/IC/LFSI/LFSI-S-A0003153929/LFSI-S-A0003153929-1.pdf?src-supplier=IHS+Markit; ComponentLink1Description: https://datasheet.ciiva.com:443/pdfs/VipMasterIC/IC/LFSI/LFSI-S-A0003153929/LFSI-S-A0003153929-1.pdf?src-supplier=IHS+Markit; ComponentLink2URL: https://datasheet.ciiva.com/34302/1546929-34302459.pdf?src-supplier=Jameco; ComponentLink2Description: https://datasheet.ciiva.com/34302/1546929-34302459.pdf?src-supplier=Jameco; ComponentLink3URL: https://datasheet.ciiva.com/25624/0900766b810f4eeb-25624712.pdf?src-supplier=Rs; ComponentLink3Description: https://datasheet.ciiva.com/25624/0900766b810f4eeb-25624712.pdf?src-supplier=Rs; ComponentLink4URL: https://datasheet.ciiva.com/46381/1677318-46381958.pdf?src-supplier=Element14; ComponentLink4Description: https://datasheet.ciiva.com/46381/1677318-46381958.pdf?src-supplier=Element14; LCSC Part Number: C83333
ESP32-S3-WROOM-1U-N16R8 = ESP32-S3-WROOM-1U-N16R8: Module; Wi-Fi/Bluetooth; transceiver; 16MB FLASH/8MB PSRAM/512KB SRAM/384KB ROM; 3.0-3.6V; 18x25.5x3.2mm; Manufacturer: Espressif Systems; Max Supply Voltage: 3.6V; Min Supply Voltage: 3V; Operating Supply Voltage: 3.3V; Supplier: DigiKey; Supplier Part Number: 1965-ESP32-S3-WROOM-1U-N16R8CT-ND; Manufacturer Part Number: ESP32-S3-WROOM-1U-N16R8; RoHS: Compliant; Category: RF Transceiver Modules and Modems; Stock: 8968; Pricing: 1=6.56, 10=5.683, 25=5.378, 100=4.9592, 250=4.7084 (USD); Height - Seated (Max): 3.35mm; Length: 19.2mm; Max Operating Temperature: 65°C; Min Operating Temperature: -40°C; Number of Terminals: 41; REACH SVHC: Yes; Terminal Pitch: 1.27mm; Width: 18mm; ComponentLink1URL: https://datasheet.octopart.com:443/ESP32-S3-WROOM-1U-N16R8-Espressif-Systems-datasheet-165560563.pdf?src-supplier=IHS; ComponentLink1Description: https://datasheet.octopart.com:443/ESP32-S3-WROOM-1U-N16R8-Espressif-Systems-datasheet-165560563.pdf?src-supplier=IHS; ComponentLink2URL: https://datasheet.octopart.com:443/ESP32-S3-WROOM-1U-N16R8-Espressif-Systems-datasheet-188867343.pdf?src-supplier=TME; ComponentLink2Description: https://datasheet.octopart.com:443/ESP32-S3-WROOM-1U-N16R8-Espressif-Systems-datasheet-188867343.pdf?src-supplier=TME; ComponentLink3URL: https://datasheet.octopart.com:443/ESP32-S3-WROOM-1U-N16R8-Espressif-Systems-datasheet-165560559.pdf?src-supplier=TME; ComponentLink3Description: https://datasheet.octopart.com:443/ESP32-S3-WROOM-1U-N16R8-Espressif-Systems-datasheet-165560559.pdf?src-supplier=TME; LCSC Part Number: C49164661
F1 F2 = 696108003002: Fuses/Accessories; Manufacturer: Wurth Electronics; Supplier: Digikey; Supplier Part Number: 732-11376-ND; Manufacturer Part Number: 696108003002; RoHS: Yes; Category: Fuse Holders; Stock: 8623; Pricing: 1=0.61, 10=0.581, 50=0.5518, 100=0.4923, 250=0.43292, 500=0.3537 (USD); RoHS Compliant: Yes; ComponentLink1URL: https://datasheet.ciiva.com:443/pdfs/VipMasterIC/IC/MIDC/MIDC-S-A0001527535/MIDC-S-A0001527562-1.pdf?src-supplier=IHS+Markit; ComponentLink1Description: https://datasheet.ciiva.com:443/pdfs/VipMasterIC/IC/MIDC/MIDC-S-A0001527535/MIDC-S-A0001527562-1.pdf?src-supplier=IHS+Markit; ComponentLink2URL: https://katalog.we-online.de/em/datasheet/696108003002.pdf?src-supplier=Digikey; ComponentLink2Description: https://katalog.we-online.de/em/datasheet/696108003002.pdf?src-supplier=Digikey; ComponentLink3URL: http://www.farnell.com/cad/1897313.pdf?src-supplier=Element14; ComponentLink3Description: http://www.farnell.com/cad/1897313.pdf?src-supplier=Element14